# Altium schematic sheet BinaryClock_LEDs.SchDoc
size 594 x 420 mm; Scale: 1:1; Разраб.: Яковлев; Номер листа: 2; Наименование изделия 1: Бинарные часы; Наименование изделия 2: Схема электрическая; Наименование изделия 3: принципиальная
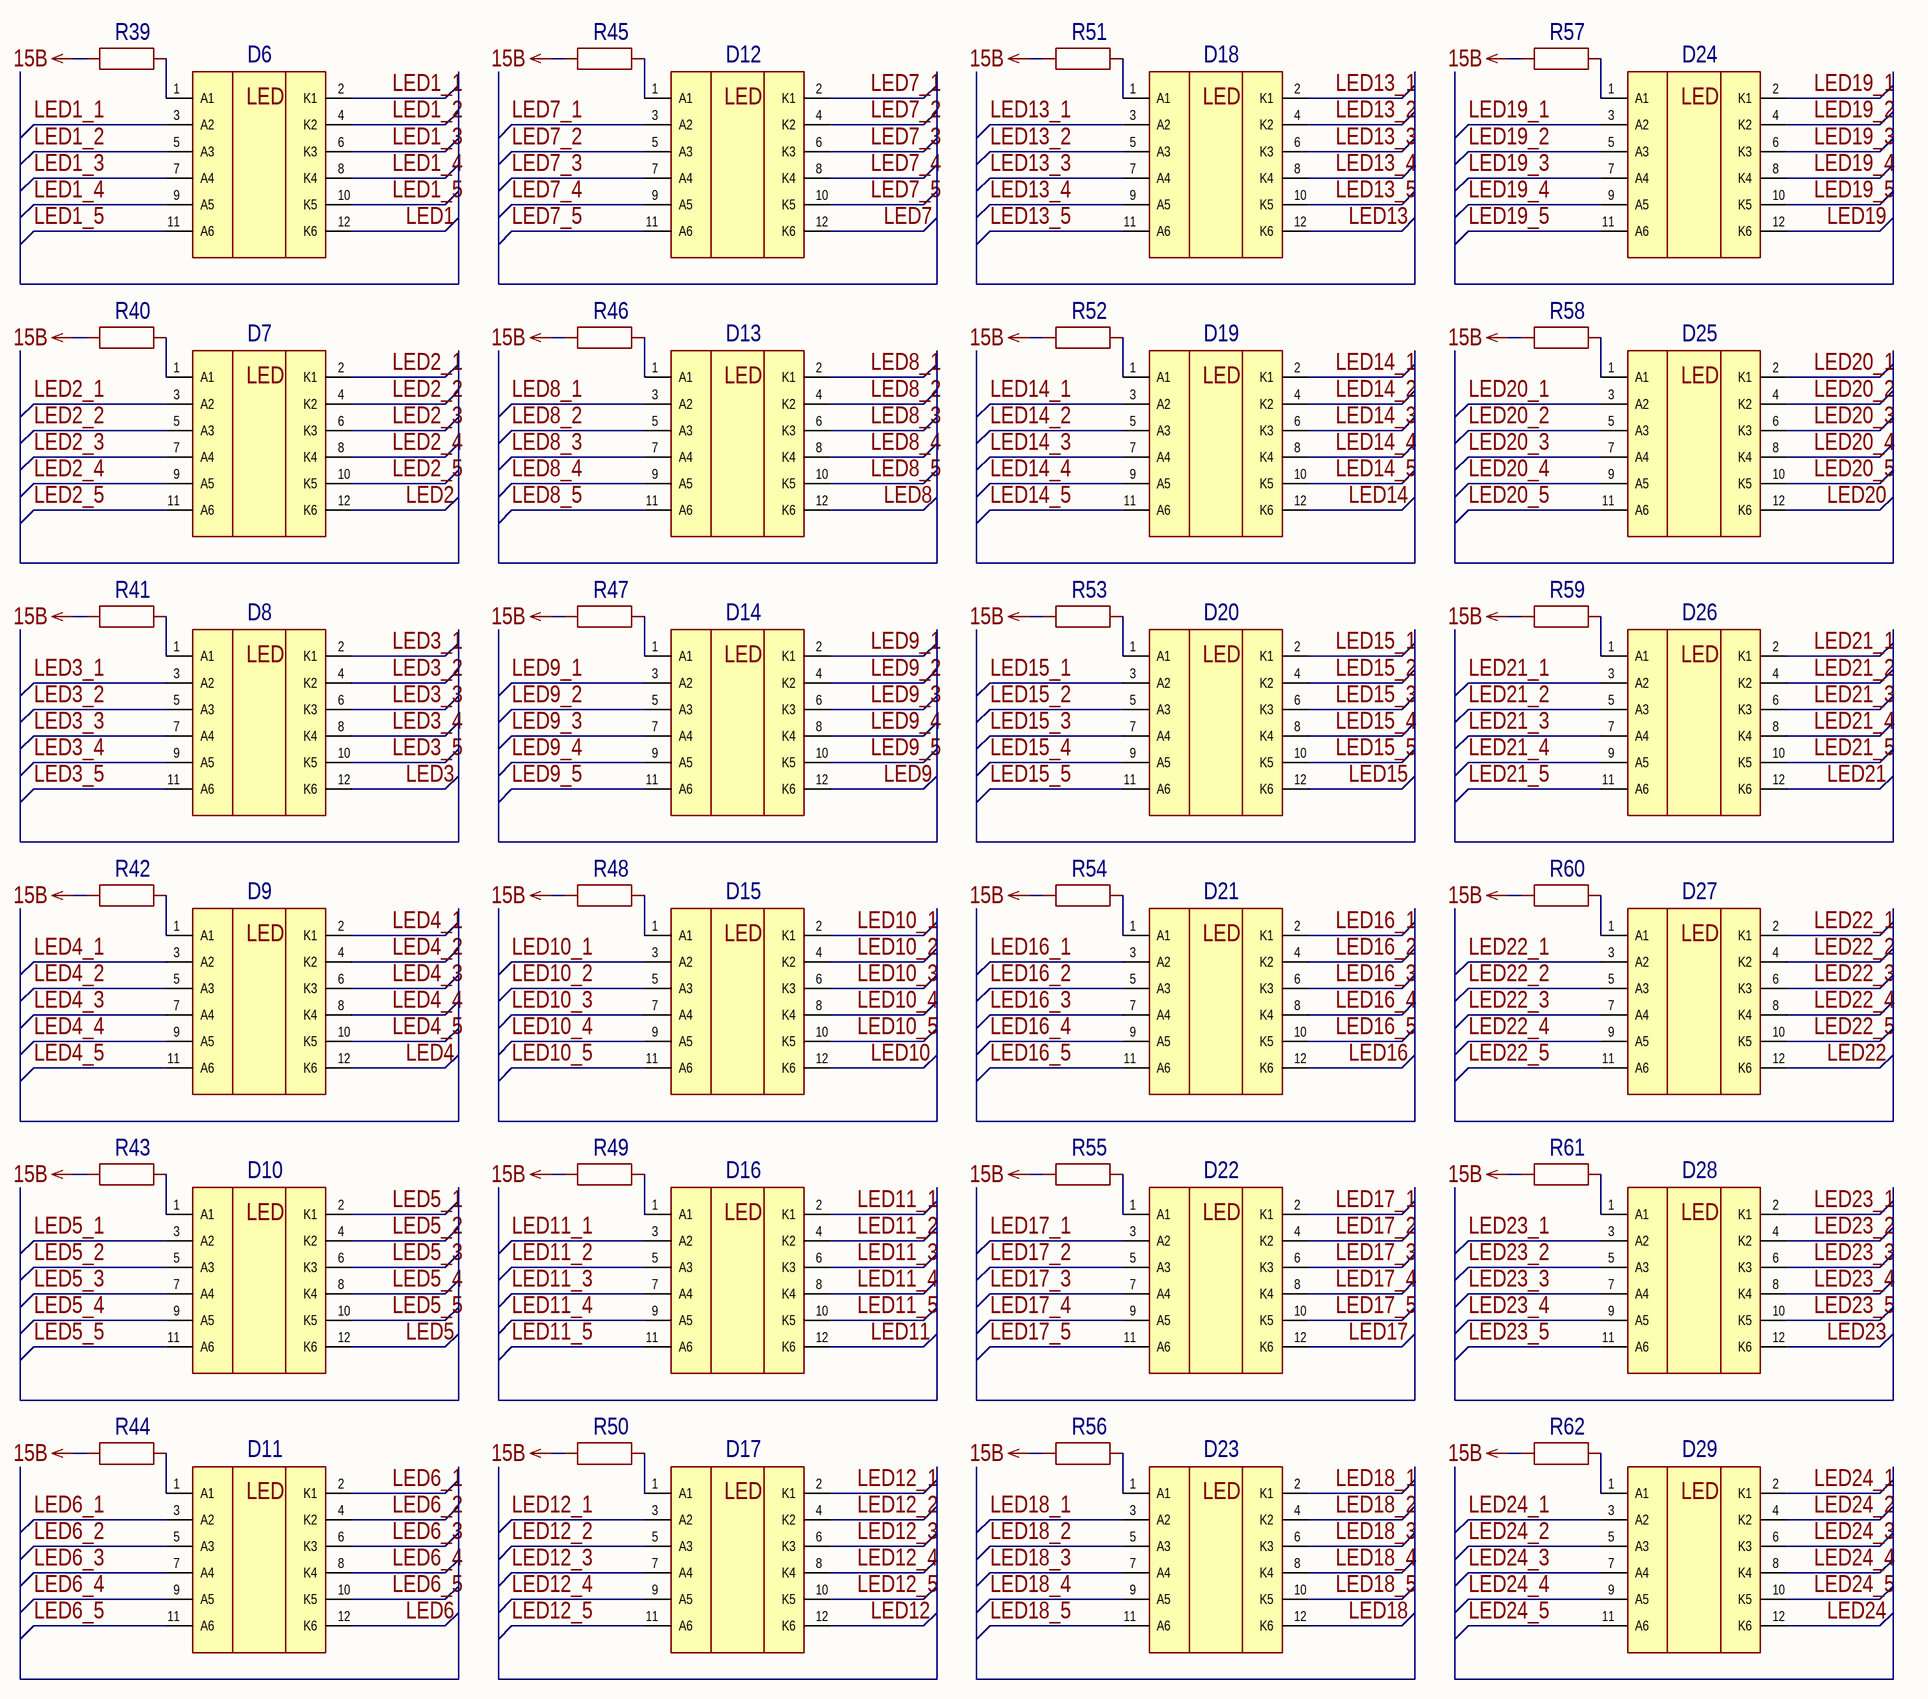
[diagram p0: BinaryClock_LEDs.SchDoc]

## Parts
D6  DLA/6ID  [DLA/6ID]  (value not drawn)
D7  DLA/6ID  [DLA/6ID]  (value not drawn)
D8  DLA/6ID  [DLA/6ID]  (value not drawn)
D9  DLA/6ID  [DLA/6ID]  (value not drawn)
D10  DLA/6ID  [DLA/6ID]  (value not drawn)
D11  DLA/6ID  [DLA/6ID]  (value not drawn)
D12  DLA/6ID  [DLA/6ID]  (value not drawn)
D13  DLA/6ID  [DLA/6ID]  (value not drawn)
D14  DLA/6YD  [DLA/6YD]  (value not drawn)
D15  DLA/6YD  [DLA/6YD]  (value not drawn)
D16  DLA/6YD  [DLA/6YD]  (value not drawn)
D17  DLA/6YD  [DLA/6YD]  (value not drawn)
D18  DLA/6YD  [DLA/6YD]  (value not drawn)
D19  DLA/6YD  [DLA/6YD]  (value not drawn)
D20  DLA/6YD  [DLA/6YD]  (value not drawn)
D21  DLA/6YD  [DLA/6YD]  (value not drawn)
D22  DLA/6GD  [DLA/6GD]  (value not drawn)
D23  DLA/6GD  [DLA/6GD]  (value not drawn)
D24  DLA/6GD  [DLA/6GD]  (value not drawn)
D25  DLA/6GD  [DLA/6GD]  (value not drawn)
D26  DLA/6GD  [DLA/6GD]  (value not drawn)
D27  DLA/6GD  [DLA/6GD]  (value not drawn)
D28  DLA/6GD  [DLA/6GD]  (value not drawn)
D29  DLA/6GD  [DLA/6GD]  (value not drawn)
R39  0805±1 %-? кОм  [SMD-0805-RES]  (value not drawn)
R40  0805±1 %-? кОм  [SMD-0805-RES]  (value not drawn)
R41  0805±1 %-? кОм  [SMD-0805-RES]  (value not drawn)
R42  0805±1 %-? кОм  [SMD-0805-RES]  (value not drawn)
R43  0805±1 %-? кОм  [SMD-0805-RES]  (value not drawn)
R44  0805±1 %-? кОм  [SMD-0805-RES]  (value not drawn)
R45  0805±1 %-? кОм  [SMD-0805-RES]  (value not drawn)
R46  0805±1 %-? кОм  [SMD-0805-RES]  (value not drawn)
R47  0805±1 %-? кОм  [SMD-0805-RES]  (value not drawn)
R48  0805±1 %-? кОм  [SMD-0805-RES]  (value not drawn)
R49  0805±1 %-? кОм  [SMD-0805-RES]  (value not drawn)
R50  0805±1 %-? кОм  [SMD-0805-RES]  (value not drawn)
R51  0805±1 %-? кОм  [SMD-0805-RES]  (value not drawn)
R52  0805±1 %-? кОм  [SMD-0805-RES]  (value not drawn)
R53  0805±1 %-? кОм  [SMD-0805-RES]  (value not drawn)
R54  0805±1 %-? кОм  [SMD-0805-RES]  (value not drawn)
R55  0805±1 %-? кОм  [SMD-0805-RES]  (value not drawn)
R56  0805±1 %-? кОм  [SMD-0805-RES]  (value not drawn)
R57  0805±1 %-? кОм  [SMD-0805-RES]  (value not drawn)
R58  0805±1 %-? кОм  [SMD-0805-RES]  (value not drawn)
R59  0805±1 %-? кОм  [SMD-0805-RES]  (value not drawn)
R60  0805±1 %-? кОм  [SMD-0805-RES]  (value not drawn)
R61  0805±1 %-? кОм  [SMD-0805-RES]  (value not drawn)
R62  0805±1 %-? кОм  [SMD-0805-RES]  (value not drawn)

## Nets
15В: R39.1 R40.1 R41.1 R42.1 R43.1 R44.1 R45.1 R46.1 R47.1 R48.1 R49.1 R50.1 R51.1 R52.1 R53.1 R54.1 R55.1 R56.1 R57.1 R58.1 R59.1 R60.1 R61.1 R62.1
LED1: D6.12(K6)
LED1_1: D6.2(K1) D6.3(A2)
LED1_2: D6.4(K2) D6.5(A3)
LED1_3: D6.6(K3) D6.7(A4)
LED1_4: D6.8(K4) D6.9(A5)
LED1_5: D6.10(K5) D6.11(A6)
LED2: D7.12(K6)
LED2_1: D7.2(K1) D7.3(A2)
LED2_2: D7.4(K2) D7.5(A3)
LED2_3: D7.6(K3) D7.7(A4)
LED2_4: D7.8(K4) D7.9(A5)
LED2_5: D7.10(K5) D7.11(A6)
LED3: D8.12(K6)
LED3_1: D8.2(K1) D8.3(A2)
LED3_2: D8.4(K2) D8.5(A3)
LED3_3: D8.6(K3) D8.7(A4)
LED3_4: D8.8(K4) D8.9(A5)
LED3_5: D8.10(K5) D8.11(A6)
LED4: D9.12(K6)
LED4_1: D9.2(K1) D9.3(A2)
LED4_2: D9.4(K2) D9.5(A3)
LED4_3: D9.6(K3) D9.7(A4)
LED4_4: D9.8(K4) D9.9(A5)
LED4_5: D9.10(K5) D9.11(A6)
LED5: D10.12(K6)
LED5_1: D10.2(K1) D10.3(A2)
LED5_2: D10.4(K2) D10.5(A3)
LED5_3: D10.6(K3) D10.7(A4)
LED5_4: D10.8(K4) D10.9(A5)
LED5_5: D10.10(K5) D10.11(A6)
LED6: D11.12(K6)
LED6_1: D11.2(K1) D11.3(A2)
LED6_2: D11.4(K2) D11.5(A3)
LED6_3: D11.6(K3) D11.7(A4)
LED6_4: D11.8(K4) D11.9(A5)
LED6_5: D11.10(K5) D11.11(A6)
LED7: D12.12(K6)
LED7_1: D12.2(K1) D12.3(A2)
LED7_2: D12.4(K2) D12.5(A3)
LED7_3: D12.6(K3) D12.7(A4)
LED7_4: D12.8(K4) D12.9(A5)
LED7_5: D12.10(K5) D12.11(A6)
LED8: D13.12(K6)
LED8_1: D13.2(K1) D13.3(A2)
LED8_2: D13.4(K2) D13.5(A3)
LED8_3: D13.6(K3) D13.7(A4)
LED8_4: D13.8(K4) D13.9(A5)
LED8_5: D13.10(K5) D13.11(A6)
LED9: D14.12(K6)
LED9_1: D14.2(K1) D14.3(A2)
LED9_2: D14.4(K2) D14.5(A3)
LED9_3: D14.6(K3) D14.7(A4)
LED9_4: D14.8(K4) D14.9(A5)
LED9_5: D14.10(K5) D14.11(A6)
LED10: D15.12(K6)
LED10_1: D15.2(K1) D15.3(A2)
LED10_2: D15.4(K2) D15.5(A3)
LED10_3: D15.6(K3) D15.7(A4)
LED10_4: D15.8(K4) D15.9(A5)
LED10_5: D15.10(K5) D15.11(A6)
LED11: D16.12(K6)
LED11_1: D16.2(K1) D16.3(A2)
LED11_2: D16.4(K2) D16.5(A3)
LED11_3: D16.6(K3) D16.7(A4)
LED11_4: D16.8(K4) D16.9(A5)
LED11_5: D16.10(K5) D16.11(A6)
LED12: D17.12(K6)
LED12_1: D17.2(K1) D17.3(A2)
LED12_2: D17.4(K2) D17.5(A3)
LED12_3: D17.6(K3) D17.7(A4)
LED12_4: D17.8(K4) D17.9(A5)
LED12_5: D17.10(K5) D17.11(A6)
LED13: D18.12(K6)
LED13_1: D18.2(K1) D18.3(A2)
LED13_2: D18.4(K2) D18.5(A3)
LED13_3: D18.6(K3) D18.7(A4)
LED13_4: D18.8(K4) D18.9(A5)
LED13_5: D18.10(K5) D18.11(A6)
LED14: D19.12(K6)
LED14_1: D19.2(K1) D19.3(A2)
LED14_2: D19.4(K2) D19.5(A3)
LED14_3: D19.6(K3) D19.7(A4)
LED14_4: D19.8(K4) D19.9(A5)
LED14_5: D19.10(K5) D19.11(A6)
LED15: D20.12(K6)
LED15_1: D20.2(K1) D20.3(A2)
LED15_2: D20.4(K2) D20.5(A3)
LED15_3: D20.6(K3) D20.7(A4)
LED15_4: D20.8(K4) D20.9(A5)
LED15_5: D20.10(K5) D20.11(A6)
LED16: D21.12(K6)
LED16_1: D21.2(K1) D21.3(A2)
LED16_2: D21.4(K2) D21.5(A3)
LED16_3: D21.6(K3) D21.7(A4)
LED16_4: D21.8(K4) D21.9(A5)
LED16_5: D21.10(K5) D21.11(A6)
LED17: D22.12(K6)
LED17_1: D22.2(K1) D22.3(A2)
LED17_2: D22.4(K2) D22.5(A3)
LED17_3: D22.6(K3) D22.7(A4)
LED17_4: D22.8(K4) D22.9(A5)
LED17_5: D22.10(K5) D22.11(A6)
LED18: D23.12(K6)
LED18_1: D23.2(K1) D23.3(A2)
LED18_2: D23.4(K2) D23.5(A3)
LED18_3: D23.6(K3) D23.7(A4)
LED18_4: D23.8(K4) D23.9(A5)
LED18_5: D23.10(K5) D23.11(A6)
LED19: D24.12(K6)
LED19_1: D24.2(K1) D24.3(A2)
LED19_2: D24.4(K2) D24.5(A3)
LED19_3: D24.6(K3) D24.7(A4)
LED19_4: D24.8(K4) D24.9(A5)
LED19_5: D24.10(K5) D24.11(A6)
LED20: D25.12(K6)
LED20_1: D25.2(K1) D25.3(A2)
LED20_2: D25.4(K2) D25.5(A3)
LED20_3: D25.6(K3) D25.7(A4)
LED20_4: D25.8(K4) D25.9(A5)
LED20_5: D25.10(K5) D25.11(A6)
LED21: D26.12(K6)
LED21_1: D26.2(K1) D26.3(A2)
LED21_2: D26.4(K2) D26.5(A3)
LED21_3: D26.6(K3) D26.7(A4)
LED21_4: D26.8(K4) D26.9(A5)
LED21_5: D26.10(K5) D26.11(A6)
LED22: D27.12(K6)
LED22_1: D27.2(K1) D27.3(A2)
LED22_2: D27.4(K2) D27.5(A3)
LED22_3: D27.6(K3) D27.7(A4)
LED22_4: D27.8(K4) D27.9(A5)
LED22_5: D27.10(K5) D27.11(A6)
LED23: D28.12(K6)
LED23_1: D28.2(K1) D28.3(A2)
LED23_2: D28.4(K2) D28.5(A3)
LED23_3: D28.6(K3) D28.7(A4)
LED23_4: D28.8(K4) D28.9(A5)
LED23_5: D28.10(K5) D28.11(A6)
LED24: D29.12(K6)
LED24_1: D29.2(K1) D29.3(A2)
LED24_2: D29.4(K2) D29.5(A3)
LED24_3: D29.6(K3) D29.7(A4)
LED24_4: D29.8(K4) D29.9(A5)
LED24_5: D29.10(K5) D29.11(A6)
NetD6_1: D6.1(A1) R39.2
NetD7_1: D7.1(A1) R40.2
NetD8_1: D8.1(A1) R41.2
NetD9_1: D9.1(A1) R42.2
NetD10_1: D10.1(A1) R43.2
NetD11_1: D11.1(A1) R44.2
NetD12_1: D12.1(A1) R45.2
NetD13_1: D13.1(A1) R46.2
NetD14_1: D14.1(A1) R47.2
NetD15_1: D15.1(A1) R48.2
NetD16_1: D16.1(A1) R49.2
NetD17_1: D17.1(A1) R50.2
NetD18_1: D18.1(A1) R51.2
NetD19_1: D19.1(A1) R52.2
NetD20_1: D20.1(A1) R53.2
NetD21_1: D21.1(A1) R54.2
NetD22_1: D22.1(A1) R55.2
NetD23_1: D23.1(A1) R56.2
NetD24_1: D24.1(A1) R57.2
NetD25_1: D25.1(A1) R58.2
NetD26_1: D26.1(A1) R59.2
NetD27_1: D27.1(A1) R60.2
NetD28_1: D28.1(A1) R61.2
NetD29_1: D29.1(A1) R62.2

## Notes on the sheet
- Подп. и дата
- Инв. № дубл.
- Взам. инв. №
- Инв. № подл.
- Изм.
- Лист
- № докум.
- Подп.
- Дата
- Копировал
- Формат А2
- (in symbol DLA) LED

## Library data of the parts
D6-D29 = DLA: 20mm BIG LAMP; Manufacturer: Kingbright; ComponentLink1Description: Datasheet
  D6-D13: ComponentLink1URL: http://www.kingbright.com/attachments/file/psearch/000/00/00/DLA-6ID(Ver.14A).pdf
  D14-D21: ComponentLink1URL: http://www.kingbright.com/attachments/file/psearch/000/00/20160808bak/DLA-6YD(Ver.12A).pdf
  D22-D29: ComponentLink1URL: http://www.kingbright.com/attachments/file/psearch/000/00/00/DLA-6GD(Ver.14A).pdf
R39-R62 = Res: Resistor; Value: ? Ом; Manufacturer: *; ComponentLink1Description: Datasheet